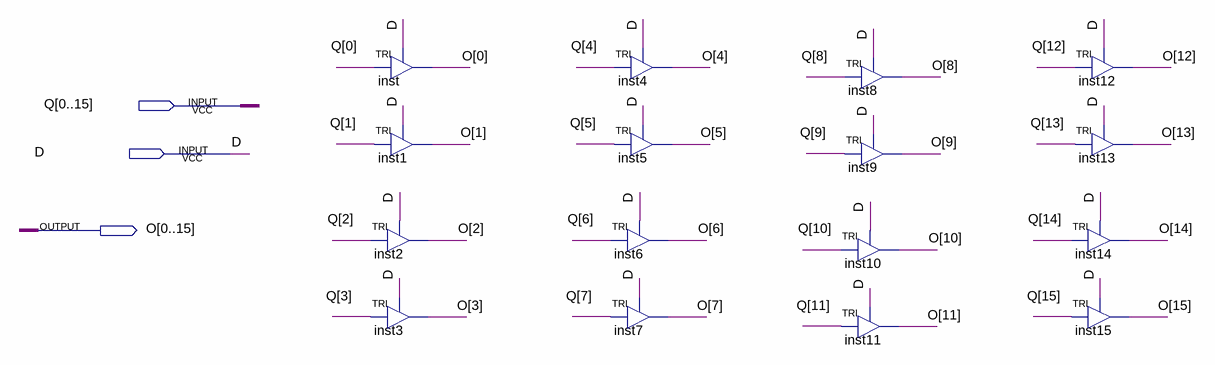
[diagram p0: schematic sheet]
// Quartus schematic tri16.bdf as structural Verilog: 16 symbols, 3 pins
module tri16 (
  input  [0:15] Q,
  input  D,
  output [0:15] O
);

  TRI inst (.IN(Q[0]), .OE(D), .OUT(O[0]));
  TRI inst1 (.IN(Q[1]), .OE(D), .OUT(O[1]));
  TRI inst2 (.IN(Q[2]), .OE(D), .OUT(O[2]));
  TRI inst3 (.IN(Q[3]), .OE(D), .OUT(O[3]));
  TRI inst4 (.IN(Q[4]), .OE(D), .OUT(O[4]));
  TRI inst5 (.IN(Q[5]), .OE(D), .OUT(O[5]));
  TRI inst6 (.IN(Q[6]), .OE(D), .OUT(O[6]));
  TRI inst7 (.IN(Q[7]), .OE(D), .OUT(O[7]));
  TRI inst8 (.IN(Q[8]), .OE(D), .OUT(O[8]));
  TRI inst9 (.IN(Q[9]), .OE(D), .OUT(O[9]));
  TRI inst10 (.IN(Q[10]), .OE(D), .OUT(O[10]));
  TRI inst11 (.IN(Q[11]), .OE(D), .OUT(O[11]));
  TRI inst12 (.IN(Q[12]), .OE(D), .OUT(O[12]));
  TRI inst13 (.IN(Q[13]), .OE(D), .OUT(O[13]));
  TRI inst14 (.IN(Q[14]), .OE(D), .OUT(O[14]));
  TRI inst15 (.IN(Q[15]), .OE(D), .OUT(O[15]));
endmodule
